# Altium project LSS_Gripper_Bottom_Board.PrjPcb (part 2 of 3)

## Sheet Controller-Sheet.SchDoc
size 420 x 297 mm; SheetNumber: 2; SheetTotal: 7
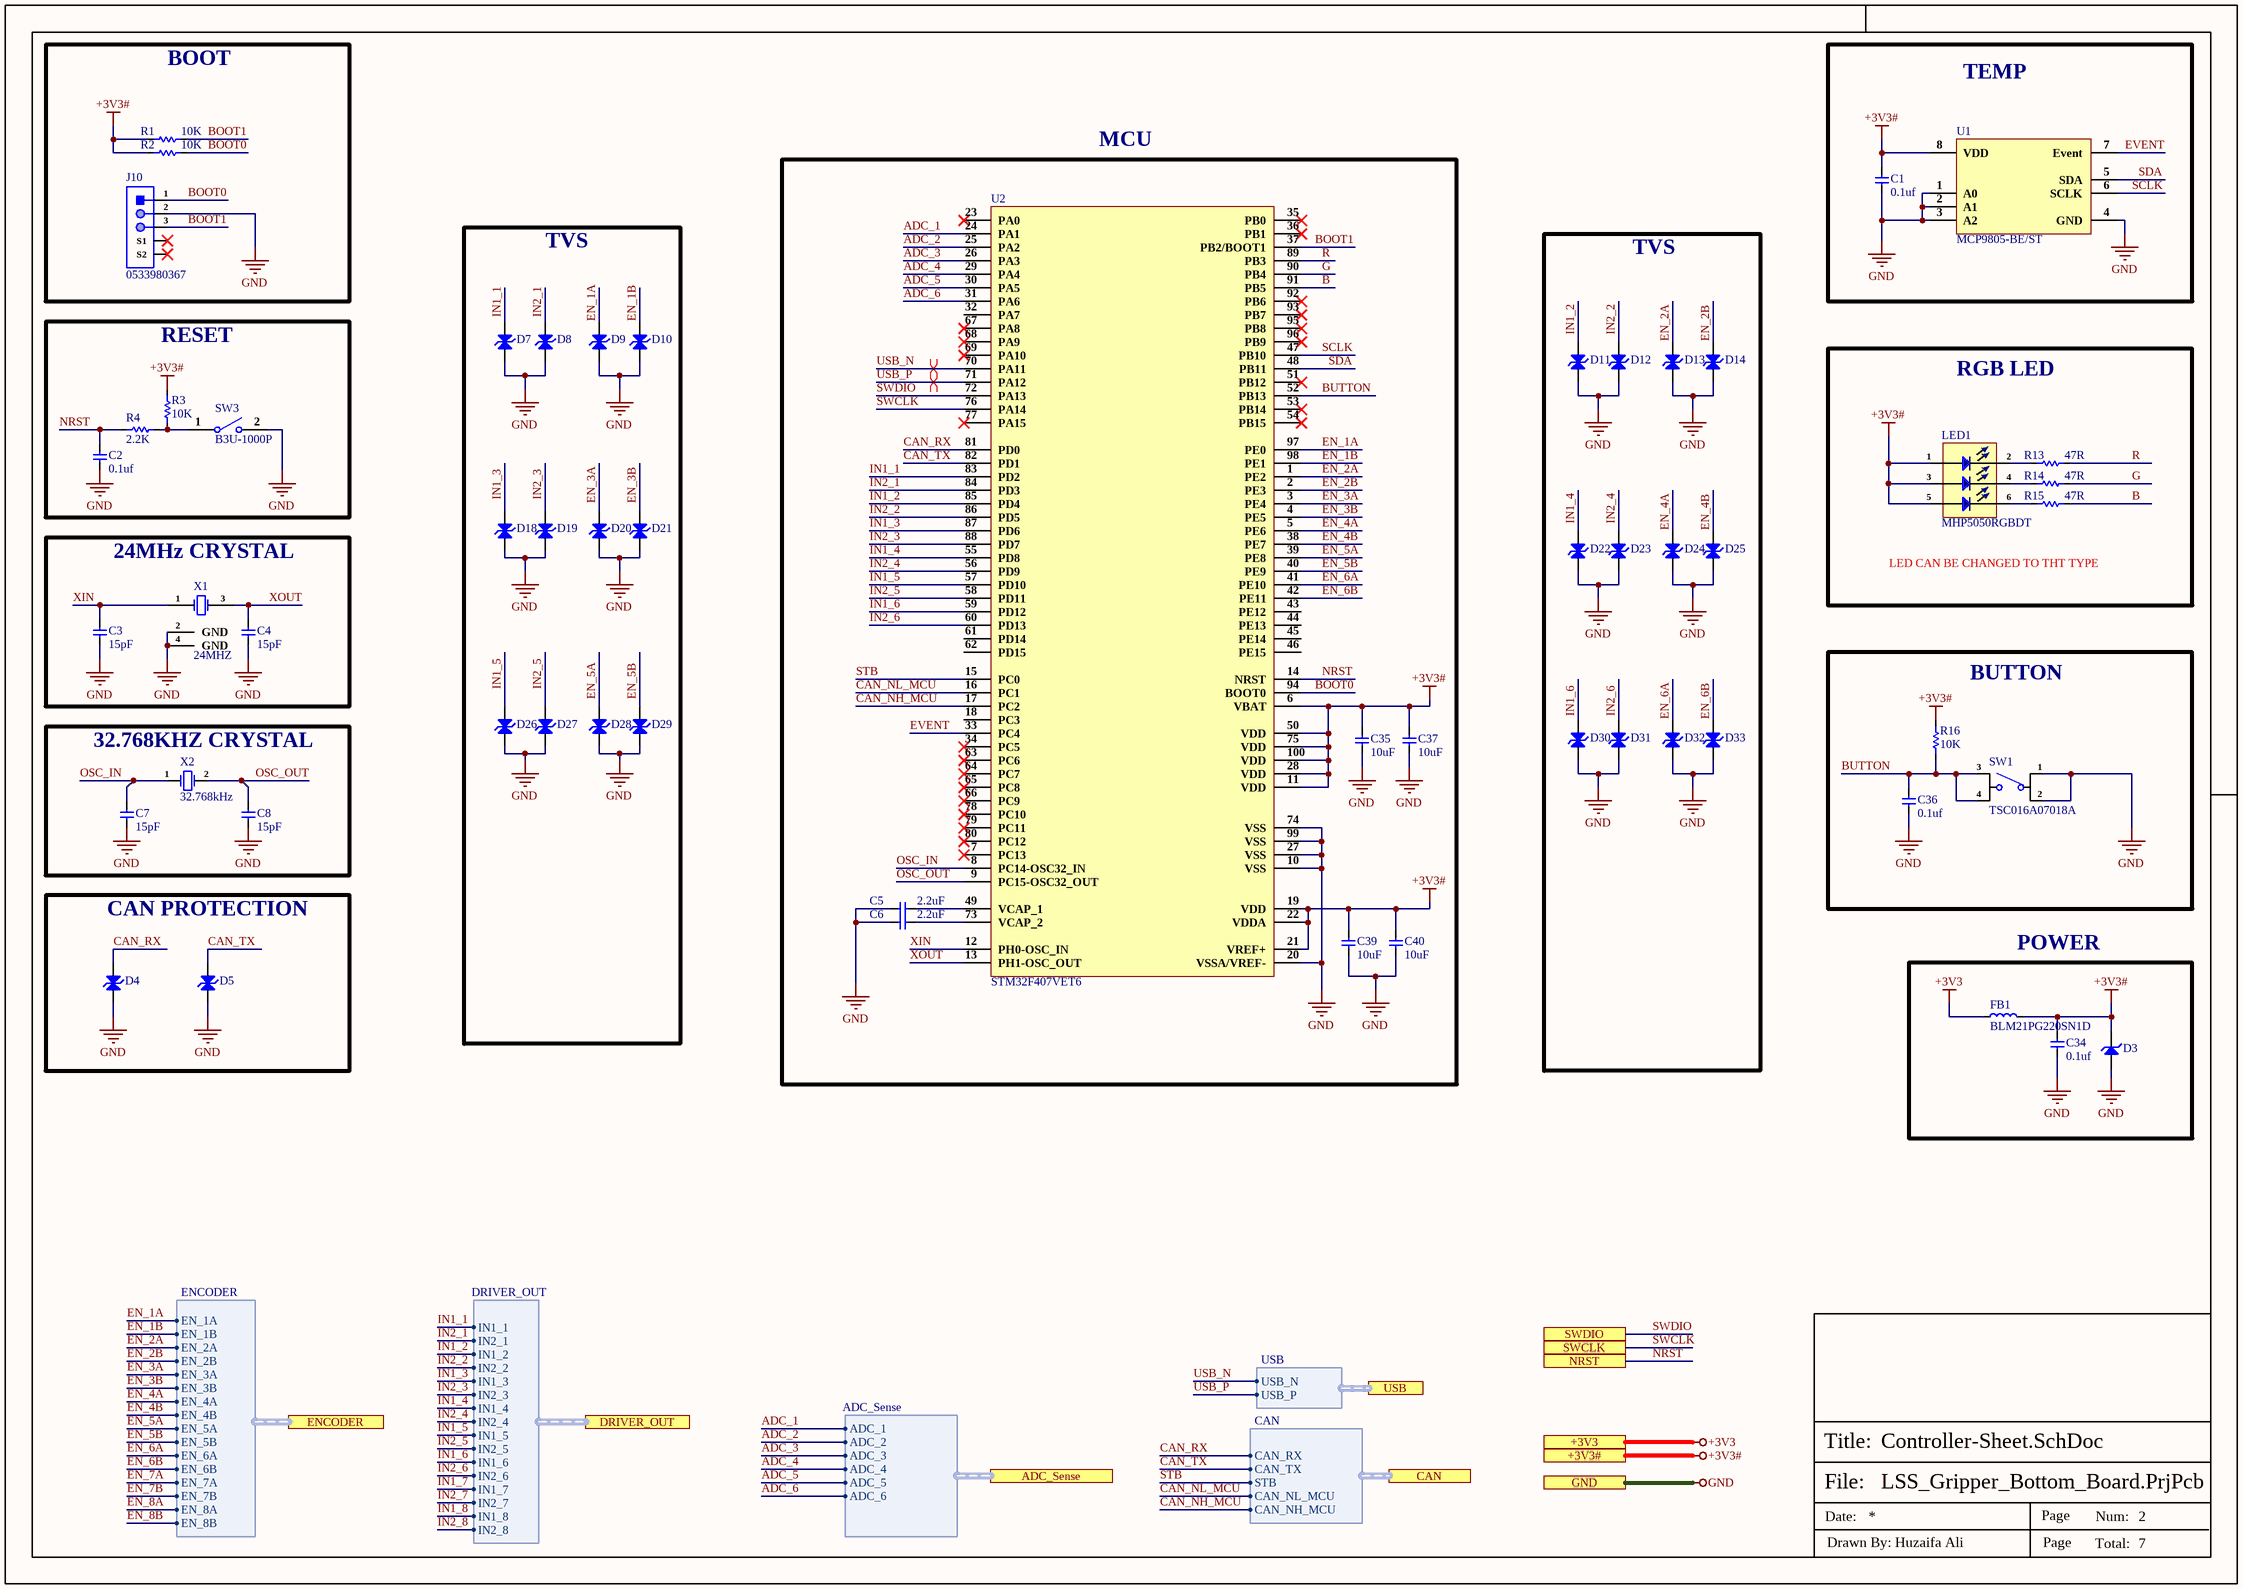
[diagram p3: Controller-Sheet.SchDoc]

### Parts
C1  0.1uf  [Cap-0402]
C2  0.1uf  [Cap-0402]
C3  15pF  [Cap-0201]
C4  15pF  [Cap-0201]
C5  2.2uF  [Cap-0402]
C6  2.2uF  [Cap-0402]
C7  15pF  [Cap-0201]
C8  15pF  [Cap-0201]
C34  0.1uf  [Cap-0402]
C35  10uF  [Cap-0402]
C36  0.1uf  [Cap-0402]
C37  10uF  [Cap-0402]
C39  10uF  [Cap-0402]
C40  10uF  [Cap-0402]
D3  AZ3003-01G  [SOD-123]  (value not drawn)
D4  PESD3V3Y1BSFYL  [DSN0603-2]  (value not drawn)
D5  PESD3V3Y1BSFYL  [DSN0603-2]  (value not drawn)
D7  PESD3V3Y1BSFYL  [DSN0603-2]  (value not drawn)
D8  PESD3V3Y1BSFYL  [DSN0603-2]  (value not drawn)
D9  PESD3V3Y1BSFYL  [DSN0603-2]  (value not drawn)
D10  PESD3V3Y1BSFYL  [DSN0603-2]  (value not drawn)
D11  PESD3V3Y1BSFYL  [DSN0603-2]  (value not drawn)
D12  PESD3V3Y1BSFYL  [DSN0603-2]  (value not drawn)
D13  PESD3V3Y1BSFYL  [DSN0603-2]  (value not drawn)
D14  PESD3V3Y1BSFYL  [DSN0603-2]  (value not drawn)
D18  PESD3V3Y1BSFYL  [DSN0603-2]  (value not drawn)
D19  PESD3V3Y1BSFYL  [DSN0603-2]  (value not drawn)
D20  PESD3V3Y1BSFYL  [DSN0603-2]  (value not drawn)
D21  PESD3V3Y1BSFYL  [DSN0603-2]  (value not drawn)
D22  PESD3V3Y1BSFYL  [DSN0603-2]  (value not drawn)
D23  PESD3V3Y1BSFYL  [DSN0603-2]  (value not drawn)
D24  PESD3V3Y1BSFYL  [DSN0603-2]  (value not drawn)
D25  PESD3V3Y1BSFYL  [DSN0603-2]  (value not drawn)
D26  PESD3V3Y1BSFYL  [DSN0603-2]  (value not drawn)
D27  PESD3V3Y1BSFYL  [DSN0603-2]  (value not drawn)
D28  PESD3V3Y1BSFYL  [DSN0603-2]  (value not drawn)
D29  PESD3V3Y1BSFYL  [DSN0603-2]  (value not drawn)
D30  PESD3V3Y1BSFYL  [DSN0603-2]  (value not drawn)
D31  PESD3V3Y1BSFYL  [DSN0603-2]  (value not drawn)
D32  PESD3V3Y1BSFYL  [DSN0603-2]  (value not drawn)
D33  PESD3V3Y1BSFYL  [DSN0603-2]  (value not drawn)
FB1  BLM21PG220SN1D  [Ind-0805]
J10  0533980367  [0533980367]
LED1  MHP5050RGBDT  [SMD5050]
R1  10K  [Res-0402]
R2  10K  [Res-0402]
R3  10K  [Res-0402]
R4  2.2K  [Res-0603]
R13  47R  [Res-0402]
R14  47R  [Res-0402]
R15  47R  [Res-0402]
R16  10K  [Res-0402]
SW1  TSC016A07018A  [TSC016A07018A]
SW3  B3U-1000P  [B3U-1000P]
U1  MCP9805-BE/ST  [8-TSSOP]
U2  STM32F407VET6  [LQFP-100]
X1  24MHZ  [X322524MOB4SI-]
X2  32.768kHz  [SMD2012-2P]

### Blocks framed on the sheet
BOOT: J10 R1 R2
TEMP: C1 U1
MCU: C5 C6 C35 C37 C39 C40 U2
TVS: D7-D10 D18-D21 D26-D29
TVS: D11-D14 D22-D25 D30-D33
RESET: C2 R3 R4 SW3
RGB LED: LED1 R13-R15
24MHz CRYSTAL: C3 C4 X1
BUTTON: C36 R16 SW1
32.768KHZ CRYSTAL: C7 C8 X2
CAN PROTECTION: D4 D5
POWER: C34 D3 FB1

### Ports
+3V3 (see Top-Sheet[3A], Connector-Sheet[5D], Motor-Driver-Sheet[5D]), +3V3# (see Top-Sheet[3A], CAN-Sheet[5D], Current-Sense-Sheet[5D]), ADC_Sense (harness ADC_Sense, see Top-Sheet[3B], Current-Sense-Sheet[3D]), CAN (harness CAN, see Top-Sheet[3B], CAN-Sheet[4D]), DRIVER_OUT (harness DRIVER_OUT, see Top-Sheet[3B], Motor-Driver-Sheet[3D]), ENCODER (harness ENCODER, see Top-Sheet[3B], Motor-Connector[2D]), GND (see Top-Sheet[3B], CAN-Sheet[5D], Connector-Sheet[5D], Current-Sense-Sheet[5D], Motor-Connector[5D], Motor-Driver-Sheet[5D]), NRST (see Top-Sheet[3A], Connector-Sheet[3D]), SWCLK (see Top-Sheet[3B], Connector-Sheet[3D]), SWDIO (see Top-Sheet[3A], Connector-Sheet[3D]), USB (harness USB, see Top-Sheet[3B], Connector-Sheet[4D])

### Harnesses
ADC_Sense: ADC_1, ADC_2, ADC_3, ADC_4, ADC_5, ADC_6
ENCODER: EN_2B, EN_3A, EN_3B, EN_4A, EN_4B, EN_5A, EN_5B, EN_6A, EN_6B, EN_7A, EN_7B, EN_2A, EN_1B, EN_1A, EN_8A, EN_8B
USB: USB_N, USB_P
DRIVER_OUT: IN1_1, IN2_1, IN1_2, IN2_2, IN1_3, IN2_3, IN1_4, IN2_4, IN1_5, IN2_5, IN1_6, IN2_6, IN1_7, IN2_7, IN1_8, IN2_8
CAN: CAN_RX, CAN_TX, STB, CAN_NL_MCU, CAN_NH_MCU

### Nets
+3V3: FB1.1 ; port +3V3
+3V3#: C1.2 C34.2 C35.2 C37.2 C39.2 C40.2 D3.2(K) FB1.2 LED1.1 LED1.3 LED1.5 R1.2 R2.2 R3.1 R16.1 U1.8(VDD) U2.6(VBAT) U2.11(VDD) U2.19(VDD) U2.21(VREF+) U2.22(VDDA) U2.28(VDD) U2.50(VDD) U2.75(VDD) U2.100(VDD) ; port +3V3#
GND: C1.1 C2.1 C3.1 C4.1 C5.1 C6.1 C7.1 C8.1 C34.1 C35.1 C36.1 C37.1 C39.1 C40.1 D3.1(A) D4.1(A) D5.1(A) D7.1(A) D8.1(A) D9.1(A) D10.1(A) D11.1(A) D12.1(A) D13.1(A) D14.1(A) D18.1(A) D19.1(A) D20.1(A) D21.1(A) D22.1(A) D23.1(A) D24.1(A) D25.1(A) D26.1(A) D27.1(A) D28.1(A) D29.1(A) D30.1(A) D31.1(A) D32.1(A) D33.1(A) J10.2 SW1.1 SW1.2 SW3.2 U1.1(A0) U1.2(A1) U1.3(A2) U1.4(GND) U2.10(VSS) U2.20(VSSA/VREF-) U2.27(VSS) U2.74(VSS) U2.99(VSS) X1.2(GND) X1.4(GND) ; port GND
ADC_1: U2.24(PA1) ; port ADC_Sense.ADC_1
ADC_2: U2.25(PA2) ; port ADC_Sense.ADC_2
ADC_3: U2.26(PA3) ; port ADC_Sense.ADC_3
ADC_4: U2.29(PA4) ; port ADC_Sense.ADC_4
ADC_5: U2.30(PA5) ; port ADC_Sense.ADC_5
ADC_6: U2.31(PA6) ; port ADC_Sense.ADC_6
B: R15.2 U2.91(PB5)
BOOT0: J10.1 R2.1 U2.94(BOOT0)
BOOT1: J10.3 R1.1 U2.37(PB2/BOOT1)
BUTTON: C36.2 R16.2 SW1.3 SW1.4 U2.52(PB13)
CAN_NH_MCU: U2.17(PC2) ; port CAN.CAN_NH_MCU
CAN_NL_MCU: U2.16(PC1) ; port CAN.CAN_NL_MCU
CAN_RX: D4.2(A) U2.81(PD0) ; port CAN.CAN_RX
CAN_TX: D5.2(A) U2.82(PD1) ; port CAN.CAN_TX
EN_1A: D9.2(A) U2.97(PE0) ; port ENCODER.EN_1A
EN_1B: D10.2(A) U2.98(PE1) ; port ENCODER.EN_1B
EN_2A: D13.2(A) U2.1(PE2) ; port ENCODER.EN_2A
EN_2B: D14.2(A) U2.2(PE3) ; port ENCODER.EN_2B
EN_3A: D20.2(A) U2.3(PE4) ; port ENCODER.EN_3A
EN_3B: D21.2(A) U2.4(PE5) ; port ENCODER.EN_3B
EN_4A: D24.2(A) U2.5(PE6) ; port ENCODER.EN_4A
EN_4B: D25.2(A) U2.38(PE7) ; port ENCODER.EN_4B
EN_5A: D28.2(A) U2.39(PE8) ; port ENCODER.EN_5A
EN_5B: D29.2(A) U2.40(PE9) ; port ENCODER.EN_5B
EN_6A: D32.2(A) U2.41(PE10) ; port ENCODER.EN_6A
EN_6B: D33.2(A) U2.42(PE11) ; port ENCODER.EN_6B
EN_7A: port ENCODER.EN_7A
EN_7B: port ENCODER.EN_7B
EN_8A: port ENCODER.EN_8A
EN_8B: port ENCODER.EN_8B
EVENT: U1.7(Event) U2.33(PC4)
G: R14.2 U2.90(PB4)
IN1_1: D7.2(A) U2.83(PD2) ; port DRIVER_OUT.IN1_1
IN1_2: D11.2(A) U2.85(PD4) ; port DRIVER_OUT.IN1_2
IN1_3: D18.2(A) U2.87(PD6) ; port DRIVER_OUT.IN1_3
IN1_4: D22.2(A) U2.55(PD8) ; port DRIVER_OUT.IN1_4
IN1_5: D26.2(A) U2.57(PD10) ; port DRIVER_OUT.IN1_5
IN1_6: D30.2(A) U2.59(PD12) ; port DRIVER_OUT.IN1_6
IN1_7: port DRIVER_OUT.IN1_7
IN1_8: port DRIVER_OUT.IN1_8
IN2_1: D8.2(A) U2.84(PD3) ; port DRIVER_OUT.IN2_1
IN2_2: D12.2(A) U2.86(PD5) ; port DRIVER_OUT.IN2_2
IN2_3: D19.2(A) U2.88(PD7) ; port DRIVER_OUT.IN2_3
IN2_4: D23.2(A) U2.56(PD9) ; port DRIVER_OUT.IN2_4
IN2_5: D27.2(A) U2.58(PD11) ; port DRIVER_OUT.IN2_5
IN2_6: D31.2(A) U2.60(PD13) ; port DRIVER_OUT.IN2_6
IN2_7: port DRIVER_OUT.IN2_7
IN2_8: port DRIVER_OUT.IN2_8
NRST: C2.2 R4.1 U2.14(NRST) ; port NRST
OSC_IN: C7.2 U2.8(PC14-OSC32_IN) X2.1(OSC1)
OSC_OUT: C8.2 U2.9(PC15-OSC32_OUT) X2.2(OSC2)
R: R13.2 U2.89(PB3)
SCLK: U1.6(SCLK) U2.47(PB10)
SDA: U1.5(SDA) U2.48(PB11)
STB: U2.15(PC0) ; port CAN.STB
SWCLK: U2.76(PA14) ; port SWCLK
SWDIO: U2.72(PA13) ; port SWDIO
USB_N: U2.70(PA11) ; port USB.USB_N
USB_P: U2.71(PA12) ; port USB.USB_P
XIN: C3.2 U2.12(PH0-OSC_IN) X1.1(CRYSTAL)
XOUT: C4.2 U2.13(PH1-OSC_OUT) X1.3(CRYSTAL)
NetC5_2: C5.2 U2.49(VCAP_1)
NetC6_2: C6.2 U2.73(VCAP_2)
NetLED1_2: LED1.2 R13.1
NetLED1_4: LED1.4 R14.1
NetLED1_6: LED1.6 R15.1
NetR3_2: R3.2 R4.2 SW3.1

Not connected (* = marked no-connect by the designer): J10 S1* S2*; U2 7(PC13)* 18(PC3) 23(PA0)* 32(PA7) 34(PC5)* 35(PB0)* 36(PB1)* 43(PE12) 44(PE13) 45(PE14) 46(PE15) 51(PB12)* 53(PB14)* 54(PB15)* 61(PD14) 62(PD15) 63(PC6)* 64(PC7)* 65(PC8)* 66(PC9)* 67(PA8)* 68(PA9)* 69(PA10)* 77(PA15)* 78(PC10)* 79(PC11)* 80(PC12)* 92(PB6)* 93(PB7)* 95(PB8)* 96(PB9)*

### Layout directives
differential pair; net class USB; differential pair class USB_Lines; rule Impedance Constraint [Min = 88.00    Max = 90.00    ]; rule Matched Net Lengths [Tolerance = 20mil]: USB_N, USB_P

### Notes on the sheet
- LED CAN BE CHANGED TO THT TYPE
- File:
- Title:
- Date:
- Page
- Num:
- Total:
- Drawn By: Huzaifa Ali

### Library data of the parts
C1 C2 C34 C36 = GRM155R62A104KE14D: CAP CER 0.1UF 100V X5R 0402; Manufacturer: Murata; Capacitance: 100nF; Tolerance: 10%; Item Type: Capacitor; Supplier 1: Arrow Electronics; Manufacturer Part Number: GRM155R62A104KE14D; RoHS: Yes; Category: Ceramic Capacitors; Stock 1: 870000; Pricing 1: 10000=0.00500, 20000=0.00410, 30000=0.00390, 50000=0.00370, 100000=0.00300 (USD); Mount: Surface Mount; Case/Package: 0402; Case Code (Metric): 1005; Case Code (Imperial): 0402; Weight: 0.000212oz; Min Operating Temperature: -55°C; Max Operating Temperature: 85°C; Packaging: Tape and Reel; Voltage Rating: 100V; Dielectric: X5R; Termination: SMD/SMT; Voltage Rating (DC): 100V; Package Quantity: 10000; Series: GRM; Length: 0.039inch; Width: 0.02inch; Height: 0.5mm; Thickness: 0.022inch; Reach SVHC Compliant: Yes; Lead Free: Lead Free; RoHS Compliant: Yes; ComponentLink1URL: http://www.farnell.com/datasheets/2079151.pdf?src-supplier=Farnell; ComponentLink1Description: http://www.farnell.com/datasheets/2079151.pdf?src-supplier=Farnell; ComponentLink2URL: http://www.mouser.com/ds/2/281/c02e-2905.pdf?src-supplier=Mouser; ComponentLink2Description: http://www.mouser.com/ds/2/281/c02e-2905.pdf?src-supplier=Mouser; ComponentLink3URL: http://www.farnell.com/datasheets/2079151.pdf?src-supplier=Element14; ComponentLink3Description: http://www.farnell.com/datasheets/2079151.pdf?src-supplier=Element14; ComponentLink4URL: http://search.murata.co.jp/Ceramy/image/img/A01X/G101/ENG/GRM155R62A104KE14-01.pdf?src-supplier=Digi-Key; ComponentLink4Description: http://search.murata.co.jp/Ceramy/image/img/A01X/G101/ENG/GRM155R62A104KE14-01.pdf?src-supplier=Digi-Key; ComponentLink5URL: http://www.farnell.com/datasheets/2079151.pdf?src-supplier=Newark; ComponentLink5Description: http://www.farnell.com/datasheets/2079151.pdf?src-supplier=Newark; Supplier Part Number 1: GRM155R62A104KE14D; LCSC Part Number: C162178
C3 C4 C7 C8 = CC0201JRNPO9BN150: CAP CER 15PF 50V C0G/NPO 0201; Manufacturer: Yageo; Item Type: Capacitor; Supplier: Future Electronics; Supplier Part Number: 2580314; Manufacturer Part Number: CC0201JRNPO9BN150; RoHS: Yes; Category: Ceramic Capacitors; Stock: 585000; Pricing: 15000=0.0012, 60000=0.0011, 225000=0.0011, 600000=0.001, 1500000=0.001 (USD); ComponentLink1URL: https://datasheet.ciiva.com/176/mlccorderingcode-176501.pdf?src-supplier=Digi-Key; ComponentLink1Description: https://datasheet.ciiva.com/176/mlccorderingcode-176501.pdf?src-supplier=Digi-Key; ComponentLink2URL: https://datasheet.ciiva.com/176/mlccorderingcode-176502.pdf?src-supplier=Digi-Key; ComponentLink2Description: https://datasheet.ciiva.com/176/mlccorderingcode-176502.pdf?src-supplier=Digi-Key; ComponentLink3URL: https://datasheet.ciiva.com/176/mlccorderingcode-176503.pdf?src-supplier=Digi-Key; ComponentLink3Description: https://datasheet.ciiva.com/176/mlccorderingcode-176503.pdf?src-supplier=Digi-Key; ComponentLink4URL: https://datasheet.ciiva.com/17205/upy-gp-np0-16v-to-50v-8-17205625.pdf?src-supplier=Future+Electronics; ComponentLink4Description: https://datasheet.ciiva.com/17205/upy-gp-np0-16v-to-50v-8-17205625.pdf?src-supplier=Future+Electronics; LCSC Part Number: C277480
C5 C6 = C1005X5R0J225KTJA0E: CAP CER 2.2UF 6.3V X5R 0402; Manufacturer: TDK; Item Type: Capacitor; LCSC Part Number: C343036; Manufacturer Part Number: C1005X5R0J225KTJA0E; ComponentLink1Description: LCSC; ComponentLink1URL: https://www.lcsc.com/product-detail/Multilayer-Ceramic-Capacitors-MLCC-SMD-SMT_TDK-C1005X5R0J225KTJA0E_C343036.html
C35 C37 C39 C40 = CL05A106MP5NUNC: CAP CER 10UF 10V X5R 0402; Manufacturer: Samsung; Tolerance: 20%; Item Type: Capacitor; Supplier 1: Avnet; Manufacturer Part Number: CL05A106MP5NUNC; RoHS: Yes; Category: Ceramic Capacitors; Stock 1: 1729850; Pricing 1: 10000=0.02537 (USD); Mount: Surface Mount; Case/Package: 0402; Case Code (Metric): 1005; Case Code (Imperial): 0402; Contact Plating: Tin; Min Operating Temperature: -55°C; Max Operating Temperature: 85°C; Package Quantity: 1; Packaging: Tape and Reel; Capacitance: 10uF; Voltage Rating: 10V; Dielectric: X5R; Termination: Wraparound; Series: CL; Construction: Flat; Length: 1mm; Width: 0.02inch; Thickness: 0.028inch; Depth: 0.5mm; Radiation Hardening: No; Lead Free: Lead Free; RoHS Compliant: Yes; ComponentLink1URL: https://datasheet.ciiva.com/25721/cl05a106mp5nunc-25721584.pdf?src-supplier=Digi-Key; ComponentLink1Description: https://datasheet.ciiva.com/25721/cl05a106mp5nunc-25721584.pdf?src-supplier=Digi-Key; ComponentLink2URL: https://datasheet.ciiva.com/26838/getdatasheetpartid-745310-26838170.pdf?src-supplier=Verical; ComponentLink2Description: https://datasheet.ciiva.com/26838/getdatasheetpartid-745310-26838170.pdf?src-supplier=Verical; Supplier Part Number 1: CL05A106MP5NUNC; LCSC Part Number: C315248
D3 = AZ3003-01G: TVS SURGE PROTECTOR 1-CH 3.3V; Manufacturer: Amazing; Item Type: Diode; Manufacturer Part Number: AZ3003-01G; Package: SOD-123; LCSC Part Number: -; ComponentLink1Description: Digikey; ComponentLink1URL: https://www.digikey.com/en/products/detail/amazing/AZ3003-01G/16615352?s=N4IgTCBcDaIIIC0DMAGFSC0KCMBxEAugL5A
D4 D5 D7-D14 D18-D33 = PESD3V3Y1BSFYL: TVS DIODE 3.3VWM 3.7VC DSN0603-2; Manufacturer: Nexperia; Item Type: TVS Diodes; Supplier: Future Electronics; Supplier Part Number: 9101291; Manufacturer Part Number: PESD3V3Y1BSFYL; RoHS: No; Stock: 9000; Pricing: 9000=0.0488, 18000=0.0477, 36000=0.0466, 45000=0.0463, 135000=0.0442 (USD); ComponentLink1URL: http://www.farnell.com/datasheets/2621606.pdf?src-supplier=Farnell; ComponentLink1Description: http://www.farnell.com/datasheets/2621606.pdf?src-supplier=Farnell; ComponentLink2URL: http://www.farnell.com/datasheets/2621606.pdf?src-supplier=Newark; ComponentLink2Description: http://www.farnell.com/datasheets/2621606.pdf?src-supplier=Newark; LCSC Part Number: C552535
FB1 = BLM21PG220SN1D: FERRITE BEAD 22 OHM 0805 1LN; Manufacturer: Murata; Supplier: Rs; Supplier Part Number: 7241539P; Manufacturer Part Number: BLM21PG220SN1D; RoHS: Yes; Category: Ferrite Beads and Chips; Stock: 10325; Pricing: 500=0.043, 1000=0.038, 2500=0.033, 5000=0.03 (GBP); ComponentLink1URL: https://datasheet.ciiva.com/14122/anblm21p-data-e-14122211.pdf?src-supplier=Distrelec; ComponentLink1Description: https://datasheet.ciiva.com/14122/anblm21p-data-e-14122211.pdf?src-supplier=Distrelec; ComponentLink2URL: https://datasheet.ciiva.com/11799/0900766b81275e31-11799177.pdf?src-supplier=Rs; ComponentLink2Description: https://datasheet.ciiva.com/11799/0900766b81275e31-11799177.pdf?src-supplier=Rs; ComponentLink3URL: https://datasheet.ciiva.com/29700/1845312-29700540.pdf?src-supplier=Jameco; ComponentLink3Description: https://datasheet.ciiva.com/29700/1845312-29700540.pdf?src-supplier=Jameco; ComponentLink4URL: https://datasheet.ciiva.com/16291/l0110s0100blm21p-16291622.pdf?src-supplier=Future+Electronics; ComponentLink4Description: https://datasheet.ciiva.com/16291/l0110s0100blm21p-16291622.pdf?src-supplier=Future+Electronics; ComponentLink5URL: https://datasheet.ciiva.com/8021/5160-8021589.pdf?src-supplier=Element14; ComponentLink5Description: https://datasheet.ciiva.com/8021/5160-8021589.pdf?src-supplier=Element14; ComponentLink6URL: https://datasheet.ciiva.com/8021/5160-8021591.pdf?src-supplier=Element14; ComponentLink6Description: https://datasheet.ciiva.com/8021/5160-8021591.pdf?src-supplier=Element14; ComponentLink7URL: https://datasheet.ciiva.com/6211/l0110s0100blm21p-6211741.pdf?src-supplier=Digi-Key; ComponentLink7Description: https://datasheet.ciiva.com/6211/l0110s0100blm21p-6211741.pdf?src-supplier=Digi-Key; ComponentLink8URL: https://datasheet.ciiva.com/3081/l0110s0100blm21p-3081653.pdf?src-supplier=Avnet; ComponentLink8Description: https://datasheet.ciiva.com/3081/l0110s0100blm21p-3081653.pdf?src-supplier=Avnet; ComponentLink9URL: https://datasheet.ciiva.com/41449/001171738-da-01-en-chip-drossel0805-22r0-6000ma-2-0x1-25mm-41449366.pdf?src-supplier=Conrad; ComponentLink9Description: https://datasheet.ciiva.com/41449/001171738-da-01-en-chip-drossel0805-22r0-6000ma-2-0x1-25mm-41449366.pdf?src-supplier=Conrad; LCSC Part Number: C88993; Item Type: Ferrite Bead
J10 = 0533980367: CONN HEADER SMD 3POS 1.25MM; Manufacturer: Molex; Item Type: Wire To Board Connector; Supplier: Mouser; Supplier Part Number: 538-53398-0367; Manufacturer Part Number: 0533980367; RoHS: Yes; Stock: 5361; Pricing: 1=1.41, 10=1.17, 50=1.17, 100=0.963, 1000=0.77, 10000=0.634 (USD); ComponentLink1URL: https://datasheet.ciiva.com/2944/533980367-sd-2944045.pdf?src-supplier=Digikey; ComponentLink1Description: https://datasheet.ciiva.com/2944/533980367-sd-2944045.pdf?src-supplier=Digikey; LCSC Part Number: C17555262
LED1 = MHP5050RGBDT: 20mA White Diffused -40℃~+85℃ RGB SMD5050 Light Emitting Diodes (LED) ROHS; Manufacturer: MEIHUA; Item Type: RGB LED; Manufacturer Part Number: MHP5050RGBDT; LCSC Part Number: C409780; Package: SMD5050; ComponentLink1Description: LCSC; ComponentLink1URL: https://www.lcsc.com/product-detail/Light-Emitting-Diodes-LED_MEIHUA-MHP5050RGBDT_C409780.html
R1-R3 R16 = RC0402FR-0710KL: RES 10K OHM 1% 1/16W 0402; Manufacturer: Yageo; Resistance: 10kR; Voltage Rating (DC): 50V; Temperature Coefficient: 100ppm/°C; Power Rating: 62.5mW; Max Power Dissipation: 63mW; Item Type: Resistor; Supplier 1: Mouser; Manufacturer Part Number: RC0402FR-0710KL; RoHS: Yes; Category: Chip SMD Resistors; Stock 1: 18648329; Pricing 1: 1=0.10000, 10=0.01400, 50=0.01400, 100=0.00500, 1000=0.00300, 10000=0.00200 (USD); Case/Package: 0402; Number of Pins: 2; Case Code (Imperial): 0402; Case Code (Metric): 1005; Min Operating Temperature: -55°C; Max Operating Temperature: 155°C; Resistor Type: Thick Film; Tolerance: 1%; Packaging: Tape and Reel; Voltage Rating: 50V; Termination: SMD/SMT; Working Voltage: 50V; Number of Terminations: 2; Features: Moisture Resistant; Series: RC; Resistance Tolerance: 1%; Construction: Rectangular; Length: 1mm; Width: 0.5mm; Height: 0.32mm; Depth: 0.5mm; Lead Pitch: 0.2mm; REACH SVHC: No SVHC; Lead Free: Lead Free; RoHS Compliant: Yes; Military Standard: Not; ComponentLink1URL: https://datasheet.ciiva.com/7660/38568-7660787.pdf?src-supplier=Element14; ComponentLink1Description: https://datasheet.ciiva.com/7660/38568-7660787.pdf?src-supplier=Element14; ComponentLink2URL: https://datasheet.ciiva.com/7849/1686128-7849814.pdf?src-supplier=Element14; ComponentLink2Description: https://datasheet.ciiva.com/7849/1686128-7849814.pdf?src-supplier=Element14; ComponentLink3URL: https://datasheet.ciiva.com/7983/1018594-7983486.pdf?src-supplier=Element14; ComponentLink3Description: https://datasheet.ciiva.com/7983/1018594-7983486.pdf?src-supplier=Element14; ComponentLink4URL: https://datasheet.ciiva.com/22747/1018594-22747512.pdf?src-supplier=Element14; ComponentLink4Description: https://datasheet.ciiva.com/22747/1018594-22747512.pdf?src-supplier=Element14; ComponentLink5URL: https://datasheet.ciiva.com/12667/pyu-rc0402-51-rohs-l-6-r-12667067.pdf?src-supplier=Mouser; ComponentLink5Description: https://datasheet.ciiva.com/12667/pyu-rc0402-51-rohs-l-6-r-12667067.pdf?src-supplier=Mouser; ComponentLink6URL: https://datasheet.ciiva.com/7849/1784430-7849813.pdf?src-supplier=Element14; ComponentLink6Description: https://datasheet.ciiva.com/7849/1784430-7849813.pdf?src-supplier=Element14; ComponentLink7URL: https://datasheet.ciiva.com/7849/1784430-7849815.pdf?src-supplier=Element14; ComponentLink7Description: https://datasheet.ciiva.com/7849/1784430-7849815.pdf?src-supplier=Element14; Supplier Part Number 1: 603-RC0402FR-0710KL; LCSC Part Number: C60490
R4 = RT0603BRB072K2L: RES SMD 2.2K OHM 0.1% 1/10W 0603; Manufacturer: Yageo; Value: 2.2kR; Max Power Dissipation: 100mW; Temperature Coefficient: 10ppm/°C; Item Type: Resistor; Supplier: Digi-Key; Supplier Part Number: YAG2182CT-ND; Manufacturer Part Number: RT0603BRB072K2L; RoHS: Yes; Category: Chip SMD Resistors; Stock: 518; Pricing: 1=0.6, 10=0.446, 50=0.3148, 100=0.2597, 500=0.1836, 1000=0.14563 (USD); Case/Package: 0603; Case Code (Metric): 1608; Case Code (Imperial): 0603; Min Operating Temperature: -55°C; Max Operating Temperature: 155°C; Packaging: Cut Tape; Number of Terminations: 2; Tolerance: 0.1%; Series: RT; RoHS Compliant: Yes; ComponentLink1URL: http://www.yageo.com/documents/recent/PYu-RT_1-to-0.01_RoHS_L_7.pdf?src-supplier=Digi-Key; ComponentLink1Description: http://www.yageo.com/documents/recent/PYu-RT_1-to-0.01_RoHS_L_7.pdf?src-supplier=Digi-Key; ComponentLink2URL: http://www.yageo.com/documents/recent/PYu-RT_1-to-0.01_RoHS_L_9.pdf?src-supplier=Digi-Key; ComponentLink2Description: http://www.yageo.com/documents/recent/PYu-RT_1-to-0.01_RoHS_L_9.pdf?src-supplier=Digi-Key; LCSC Part Number: C860297
R13-R15 = RC0402FR-0747RL: RES 47 OHM 1% 1/16W 0402; Manufacturer: Yageo; Temperature Coefficient: 100ppm/°C; Power Rating: 63mW; Voltage Rating: 50V; Item Type: Resistor; Supplier 1: Avnet; Manufacturer Part Number: RC0402FR-0747RL; RoHS: Yes; Category: Chip SMD Resistors; Stock 1: 390000; Pricing 1: 10000=0.00085 (USD); Case/Package: 0402; Case Code (Metric): 1005; Case Code (Imperial): 0402; Weight: 2.3E-05oz; Size Code: 0402; Min Operating Temperature: -55°C; Max Operating Temperature: 155°C; Resistance: 47R; Tolerance: 1%; Packaging: Tape and Reel; Resistor Type: Thick Film; Package Quantity: 1; Number of Terminations: 2; Termination: SMD/SMT; Max Power Dissipation: 63mW; Features: Moisture Resistant; Series: RC; Construction: Rectangular; Technology: THICK FILM; Resistance Tolerance: 1%; Length: 1mm; Width: 0.02inch; Height: 0.016inch; Depth: 0.5mm; Lead Free: Lead Free; Military Standard: Not; RoHS Compliant: Yes; Supplier Part Number 1: RC0402FR-0747RL; LCSC Part Number: C137973; ComponentLink1Description: LCSC; ComponentLink1URL: https://www.lcsc.com/product-detail/Chip-span-style-background-color-ff0-Resistor-span-Surface-Mount_YAGEO-RC0402FR-0747RL_C137973.html
SW1 = TSC016A07018A: 4.5mm 7mm 50mA Round Button Straight 4.5mm 180gf 12V Plugin Tactile Switches ROHS; Manufacturer: BZCN; Item Type: Connector; Manufacturer Part Number: TSC016A07018A; LCSC Part Number: C2888497; Package: Plugin
SW3 = B3U-1000P: SWITCH TACTILE SPST-NO 0.05A 12V; Manufacturer: Omron; Mechanical Life: 200000Cycles; Operating Force: 1.5N; Throw Configuration: SPST; Current Rating: 50mA; Contact Resistance: 100mR; Illumination Type: Non-Illuminated,Illuminated; Switch Travel: 0.15mm; Switch Function: Off-Mom; Actuator Type: Standard; Actuator Length: 0.4mm; Ratings: Dust Proof,IP40; ComponentLink1URL: http://www.farnell.com/datasheets/60838.pdf?src-supplier=Farnell; ComponentLink1Description: http://www.farnell.com/datasheets/60838.pdf?src-supplier=Farnell; ComponentLink2URL: http://www.farnell.com/datasheets/60838.pdf?src-supplier=Element14; ComponentLink2Description: http://www.farnell.com/datasheets/60838.pdf?src-supplier=Element14; ComponentLink3URL: https://omronfs.omron.com/en_US/ecb/products/pdf/en-b3u.pdf?src-supplier=Digi-Key; ComponentLink3Description: https://omronfs.omron.com/en_US/ecb/products/pdf/en-b3u.pdf?src-supplier=Digi-Key; ComponentLink4URL: http://www.omron.com/ecb/products/pdf/en-b3u.pdf?src-supplier=Digi-Key; ComponentLink4Description: http://www.omron.com/ecb/products/pdf/en-b3u.pdf?src-supplier=Digi-Key; ComponentLink5URL: https://www.distrelec.biz/Web/Downloads/he/et/B3U_eng_datasheet.pdf?mime=application%2Fpdf&src-supplier=Distrelec; ComponentLink5Description: https://www.distrelec.biz/Web/Downloads/he/et/B3U_eng_datasheet.pdf?mime=application%2Fpdf&src-supplier=Distrelec; ComponentLink6URL: http://www.onlinecomponents.com/productFiles/mf-OM/en-b3u.pdf?src-supplier=Onlinecomponents.com; ComponentLink6Description: http://www.onlinecomponents.com/productFiles/mf-OM/en-b3u.pdf?src-supplier=Onlinecomponents.com; Supplier 1: Digi-Key; Manufacturer Part Number: B3U-1000P; Stock 1: 116454; Pricing 1: 1=1, 10=0.961, 25=0.9064, 50=0.7976, 100=0.7251, 250=0.68888, 500=0.67074, 1000=0.52571 (USD); Mount: Surface Mount; Weight: 0.000776oz; Contact Material: Silver; Min Operating Temperature: -25°C; Max Operating Temperature: 70°C; Packaging: Tape and Reel; Voltage Rating (DC): 12V; Package Quantity: 1; Max Current Rating: 50mA; Termination: SMD/SMT; Orientation: Straight; Max Voltage Rating (DC): 12V; Electrical Life: 200000Cycles; Insulation Resistance: 100MR; Contact Current Rating: 50mA; Length: 4mm; Height: 1.2mm; Depth: 2.5mm; Width: 3mm; REACH SVHC: Unknown; Lead Free: Lead Free; ComponentLink7URL: https://www.verical.com/server-webapp/html/getDatasheet?partID=552554&src-supplier=Verical; ComponentLink7Description: https://www.verical.com/server-webapp/html/getDatasheet?partID=552554&src-supplier=Verical; ComponentLink8URL: http://www.farnell.com/datasheets/1685550.pdf?src-supplier=Element14; ComponentLink8Description: http://www.farnell.com/datasheets/1685550.pdf?src-supplier=Element14; ComponentLink9URL: http://www.farnell.com/datasheets/2610940.pdf?src-supplier=Farnell; ComponentLink9Description: http://www.farnell.com/datasheets/2610940.pdf?src-supplier=Farnell; ComponentLink10URL: https://www.alliedelec.com/m/d/4c8a9ef82804fc3c241a13c1e298fd73.pdf?src-supplier=Allied+Electronics; ComponentLink10Description: https://www.alliedelec.com/m/d/4c8a9ef82804fc3c241a13c1e298fd73.pdf?src-supplier=Allied+Electronics; Supplier Part Number 1: SW1020DKR-ND; LCSC Part Number: C231329; Item Type: Switch
U1 = MCP9805-BE/ST: IC SENSOR THERMAL 3.0V 8TSSOP; Manufacturer: Microchip; Min Supply Voltage: 3V; Max Supply Voltage: 3.6V; Output Current: 1uA; Interface: I2C,SMBus,2-Wire,Serial; Resolution: 10b; Operating Supply Current: 200uA; Accuracy: 2%; Number of Bits: 10; Output Type: I2C,Digital; Sensor Type: Temperature; Sensing Method: Resistive; ComponentLink1URL: https://datasheet.ciiva.com/22737/1678782-22737270.pdf?src-supplier=Element14; ComponentLink1Description: https://datasheet.ciiva.com/22737/1678782-22737270.pdf?src-supplier=Element14; ComponentLink2URL: https://datasheet.ciiva.com/43467/1678782-43467032.pdf?src-supplier=Farnell; ComponentLink2Description: https://datasheet.ciiva.com/43467/1678782-43467032.pdf?src-supplier=Farnell; ComponentLink3URL: https://datasheet.ciiva.com/22673/1678782-22673662.pdf?src-supplier=Element14; ComponentLink3Description: https://datasheet.ciiva.com/22673/1678782-22673662.pdf?src-supplier=Element14; Supplier 1: Digi-Key; Manufacturer Part Number: MCP9805-BE/ST; RoHS: Yes; Category: Power Management ICs; Stock 1: 667; Pricing 1: 1=0.85000, 25=0.71000, 100=0.65000 (USD); Mount: Surface Mount; Case/Package: TSSOP; Number of Pins: 8; Min Operating Temperature: -40°C; Max Operating Temperature: 125°C; Package Quantity: 100; Packaging: Rail/Tube; Max Supply Voltage (DC): 3.6V; Min Supply Voltage (DC): 3V; Termination: SMD/SMT; Length: 3mm; Width: 4.4mm; Height: 1mm; Radiation Hardening: No; REACH SVHC: No SVHC; Lead Free: Lead Free; RoHS Compliant: Yes; ComponentLink4URL: https://datasheet.ciiva.com/1514/1791047-1514016.pdf?src-supplier=Element14; ComponentLink4Description: https://datasheet.ciiva.com/1514/1791047-1514016.pdf?src-supplier=Element14; ComponentLink5URL: https://datasheet.ciiva.com/2003/21977b-2003478.pdf?src-supplier=Digi-Key; ComponentLink5Description: https://datasheet.ciiva.com/2003/21977b-2003478.pdf?src-supplier=Digi-Key; ComponentLink6URL: https://datasheet.ciiva.com/5299/21977b-77986-5299688.pdf?src-supplier=Mouser; ComponentLink6Description: https://datasheet.ciiva.com/5299/21977b-77986-5299688.pdf?src-supplier=Mouser; ComponentLink7URL: https://datasheet.ciiva.com/3279/21977b-3279902.pdf?src-supplier=Avnet; ComponentLink7Description: https://datasheet.ciiva.com/3279/21977b-3279902.pdf?src-supplier=Avnet; Supplier Part Number 1: MCP9805-BE/ST-ND; LCSC Part Number: C636441; Item Type: IC
U2 = STM32F407VET6: IC MCU 32BIT 512KB FLASH 100LQFP; Manufacturer: STMicroelectronics; Frequency: 168MHz; Number of I/Os: 82; Interface: I2C,SPI,CAN,I2S,UART,USB,Ethernet,IrDA,USART,LIN,EBI/EMI; Oscillator Type: Internal; Peripherals: Brown-out Detect/Reset,POR,PWM,WDT,DMA,LCD,I2C; Core Architecture: ARM; RAM Size: 196KB; Number of ADC Channels: 16; Number of Ethernet Channels: 1; Number of Timers/Counters: 14; Number of UART Channels: 2; Max Supply Voltage: 3.6V; Min Supply Voltage: 1.8V; Data Bus Width: 32b; Number of SPI Channels: 3; Watchdog Timer: Yes; Supplier 1: Newark; Manufacturer Part Number: STM32F407VET6; RoHS: Yes; Category: Microcontrollers; Pricing 1: 1=16.05000, 10=14.76000, 25=14.15000, 50=13.31000, 100=12.47000 (USD); Case/Package: LQFP; Number of Pins: 100; Min Operating Temperature: -40°C; Max Operating Temperature: 85°C; Packaging: Tray; Memory Type: FLASH; Memory Size: 512KB; Package Quantity: 90; Number of Programmable I/O: 82; Max Frequency: 168MHz; Number of I2C Channels: 3; Series: STM32 F4; Number of PWM Channels: 2; Length: 14.2mm; Width: 14.2mm; Height: 1.45mm; Radiation Hardening: No; RoHS Compliant: Yes; REACH SVHC: No SVHC; Lead Free: Lead Free; ComponentLink1URL: https://datasheet.ciiva.com/16330/dm00037051-16330920.pdf?src-supplier=Future+Electronics; ComponentLink1Description: https://datasheet.ciiva.com/16330/dm00037051-16330920.pdf?src-supplier=Future+Electronics; ComponentLink2URL: https://datasheet.ciiva.com/8055/1717982-8055038.pdf?src-supplier=Element14; ComponentLink2Description: https://datasheet.ciiva.com/8055/1717982-8055038.pdf?src-supplier=Element14; ComponentLink3URL: https://datasheet.ciiva.com/4837/dm00037051-492832-4837637.pdf?src-supplier=Mouser; ComponentLink3Description: https://datasheet.ciiva.com/4837/dm00037051-492832-4837637.pdf?src-supplier=Mouser; Supplier Part Number 1: 73T7121; LCSC Part Number: C28730; Item Type: IC
X1 = X322524MOB4SI: 24MHz SMD Crystal Resonator 12pF ±10ppm ±30ppm -40℃~+85℃ SMD3225-4P Crystals ROHS; Manufacturer: Yangxing Tech; ComponentLink1Description: LCSC; ComponentLink1URL: https://www.lcsc.com/product-detail/Crystals_Yangxing-Tech-X322524MOB4SI_C70590.html; Manufacturer Part Number: X322524MOB4SI; Footprint: Custom; LCSC Part Number: C70590; Item Type: Crystal
X2 = FC-12M32.768KHZ7PF20PPM: CRYSTAL 32.7680KHZ 9PF SMD; Manufacturer: Seiko Epson; ComponentLink1Description: LCSC; ComponentLink1URL: https://www.lcsc.com/product-detail/Crystals_Seiko-Epson-FC-12M32-768KHZ7PF20PPM_C99009.html; Manufacturer Part Number: FC-12M32.768KHZ7PF20PPM; Package: SMD2012-2P; LCSC Part Number: C99009; Item Type: Crystal

## Sheet Current-Sense-Sheet.SchDoc
size 420 x 297 mm; SheetNumber: 5; SheetTotal: 7
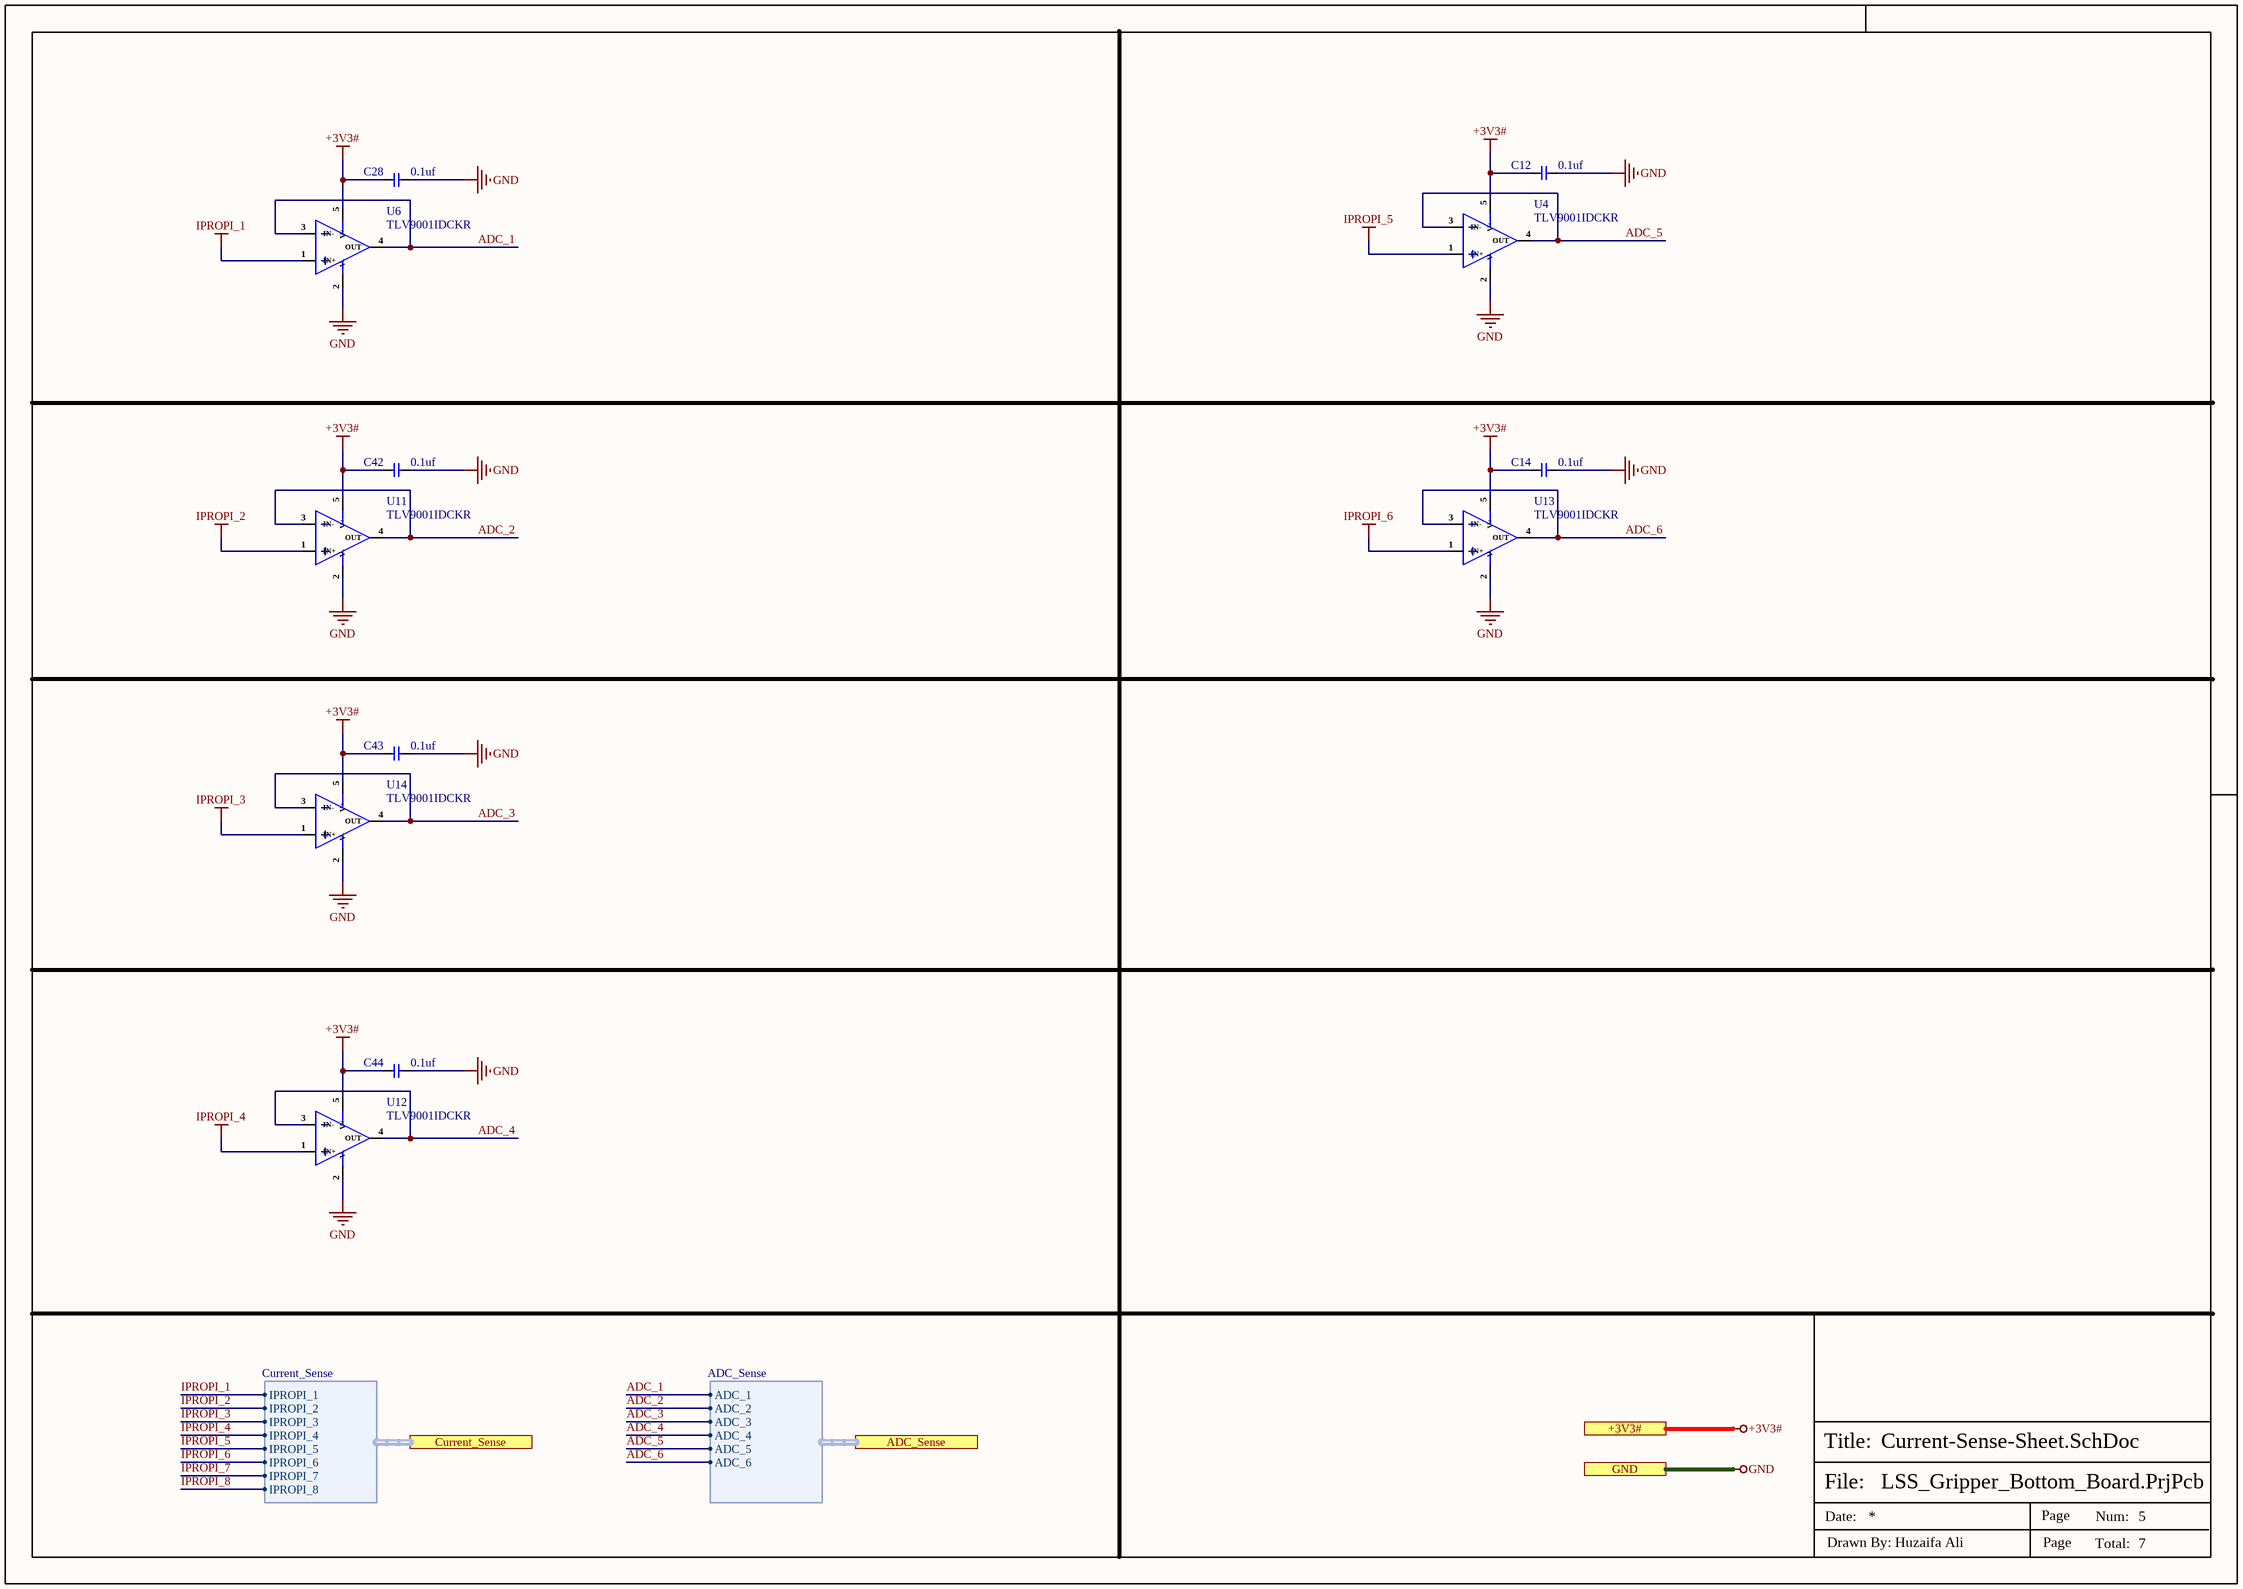
[diagram p4: Current-Sense-Sheet.SchDoc]

### Parts
C12  0.1uf  [Cap-0402]
C14  0.1uf  [Cap-0402]
C28  0.1uf  [Cap-0402]
C42  0.1uf  [Cap-0402]
C43  0.1uf  [Cap-0402]
C44  0.1uf  [Cap-0402]
U4  TLV9001IDCKR  [SC-70-5]
U6  TLV9001IDCKR  [SC-70-5]
U11  TLV9001IDCKR  [SC-70-5]
U12  TLV9001IDCKR  [SC-70-5]
U13  TLV9001IDCKR  [SC-70-5]
U14  TLV9001IDCKR  [SC-70-5]

### Ports
+3V3# (see Top-Sheet[4A], CAN-Sheet[5D], Controller-Sheet[5D]), ADC_Sense (harness ADC_Sense, see Top-Sheet[4B], Controller-Sheet[3D]), Current_Sense (harness Current_Sense, see Top-Sheet[5B], Motor-Driver-Sheet[2D]), GND (see Top-Sheet[4B], CAN-Sheet[5D], Connector-Sheet[5D], Controller-Sheet[5D], Motor-Connector[5D], Motor-Driver-Sheet[5D])

### Harnesses
Current_Sense: IPROPI_1, IPROPI_2, IPROPI_3, IPROPI_4, IPROPI_5, IPROPI_6, IPROPI_7, IPROPI_8
ADC_Sense: ADC_1, ADC_2, ADC_3, ADC_4, ADC_5, ADC_6

### Nets
+3V3#: C12.1 C14.1 C28.1 C42.1 C43.1 C44.1 U4.5(V+) U6.5(V+) U11.5(V+) U12.5(V+) U13.5(V+) U14.5(V+) ; port +3V3#
GND: C12.2 C14.2 C28.2 C42.2 C43.2 C44.2 U4.2(V-) U6.2(V-) U11.2(V-) U12.2(V-) U13.2(V-) U14.2(V-) ; port GND
IPROPI_1: U6.1(IN+) ; port Current_Sense.IPROPI_1
IPROPI_2: U11.1(IN+) ; port Current_Sense.IPROPI_2
IPROPI_3: U14.1(IN+) ; port Current_Sense.IPROPI_3
IPROPI_4: U12.1(IN+) ; port Current_Sense.IPROPI_4
IPROPI_5: U4.1(IN+) ; port Current_Sense.IPROPI_5
IPROPI_6: U13.1(IN+) ; port Current_Sense.IPROPI_6
ADC_1: U6.3(IN-) U6.4(OUT) ; port ADC_Sense.ADC_1
ADC_2: U11.3(IN-) U11.4(OUT) ; port ADC_Sense.ADC_2
ADC_3: U14.3(IN-) U14.4(OUT) ; port ADC_Sense.ADC_3
ADC_4: U12.3(IN-) U12.4(OUT) ; port ADC_Sense.ADC_4
ADC_5: U4.3(IN-) U4.4(OUT) ; port ADC_Sense.ADC_5
ADC_6: U13.3(IN-) U13.4(OUT) ; port ADC_Sense.ADC_6
IPROPI_7: port Current_Sense.IPROPI_7
IPROPI_8: port Current_Sense.IPROPI_8

### Notes on the sheet
- File:
- Title:
- Date:
- Page
- Num:
- Total:
- Drawn By: Huzaifa Ali

### Library data of the parts
C12 C14 C28 C42-C44 = GRM155R62A104KE14D: as C1 on sheet Controller-Sheet; Supplier 1: Arrow Electronics; Manufacturer Part Number: GRM155R62A104KE14D; RoHS: Yes; Category: Ceramic Capacitors; Stock 1: 870000; Pricing 1: 10000=0.00500, 20000=0.00410, 30000=0.00390, 50000=0.00370, 100000=0.00300 (USD); Mount: Surface Mount; Case/Package: 0402; Case Code (Metric): 1005; Case Code (Imperial): 0402; Weight: 0.000212oz; Min Operating Temperature: -55°C; Max Operating Temperature: 85°C; Packaging: Tape and Reel; Voltage Rating: 100V; Dielectric: X5R; Termination: SMD/SMT; Voltage Rating (DC): 100V; Package Quantity: 10000; Series: GRM; Length: 0.039inch; Width: 0.02inch; Height: 0.5mm; Thickness: 0.022inch; Reach SVHC Compliant: Yes; Lead Free: Lead Free; RoHS Compliant: Yes; ComponentLink1URL: http://www.farnell.com/datasheets/2079151.pdf?src-supplier=Farnell; ComponentLink1Description: http://www.farnell.com/datasheets/2079151.pdf?src-supplier=Farnell; ComponentLink2URL: http://www.mouser.com/ds/2/281/c02e-2905.pdf?src-supplier=Mouser; ComponentLink2Description: http://www.mouser.com/ds/2/281/c02e-2905.pdf?src-supplier=Mouser; ComponentLink3URL: http://www.farnell.com/datasheets/2079151.pdf?src-supplier=Element14; ComponentLink3Description: http://www.farnell.com/datasheets/2079151.pdf?src-supplier=Element14; ComponentLink4URL: http://search.murata.co.jp/Ceramy/image/img/A01X/G101/ENG/GRM155R62A104KE14-01.pdf?src-supplier=Digi-Key; ComponentLink4Description: http://search.murata.co.jp/Ceramy/image/img/A01X/G101/ENG/GRM155R62A104KE14-01.pdf?src-supplier=Digi-Key; ComponentLink5URL: http://www.farnell.com/datasheets/2079151.pdf?src-supplier=Newark; ComponentLink5Description: http://www.farnell.com/datasheets/2079151.pdf?src-supplier=Newark; Supplier Part Number 1: GRM155R62A104KE14D; LCSC Part Number: C162178
U4 U6 U11-U14 = TLV9001IDCKR: IC CMOS 1 CIRCUIT SC70-5; Manufacturer: Texas Instruments; Number of Channels: 1; Slew Rate: 2V/µs; Gain Bandwidth Product: 1MHz; Input Bias Current: 5pA; Input Offset Voltage (Vos): 400uV; Operating Supply Current: 60uA; Output Current per Channel: 40mA; Supplier: Mouser; Supplier Part Number: 595-TLV9001IDCKR; Manufacturer Part Number: TLV9001IDCKR; RoHS: Yes; Item Type: IC; Stock: 13115; Pricing: 1=0.47, 10=0.348, 50=0.348, 100=0.194, 1000=0.146, 10000=0.117 (USD); Mounting Technology: Surface Mount; Min Operating Temperature: -40°C; Max Operating Temperature: 125°C; Packaging: Cut Tape; Number of Circuits: 1; Series: -; RoHS Compliant: Yes; ComponentLink1URL: http://www.ti.com/lit/ds/symlink/tlv9001.pdf?src-supplier=Digikey; ComponentLink1Description: http://www.ti.com/lit/ds/symlink/tlv9001.pdf?src-supplier=Digikey; LCSC Part Number: C398362

## Sheet Motor-Connector.SchDoc
size 420 x 297 mm; SheetNumber: 3; SheetTotal: 7
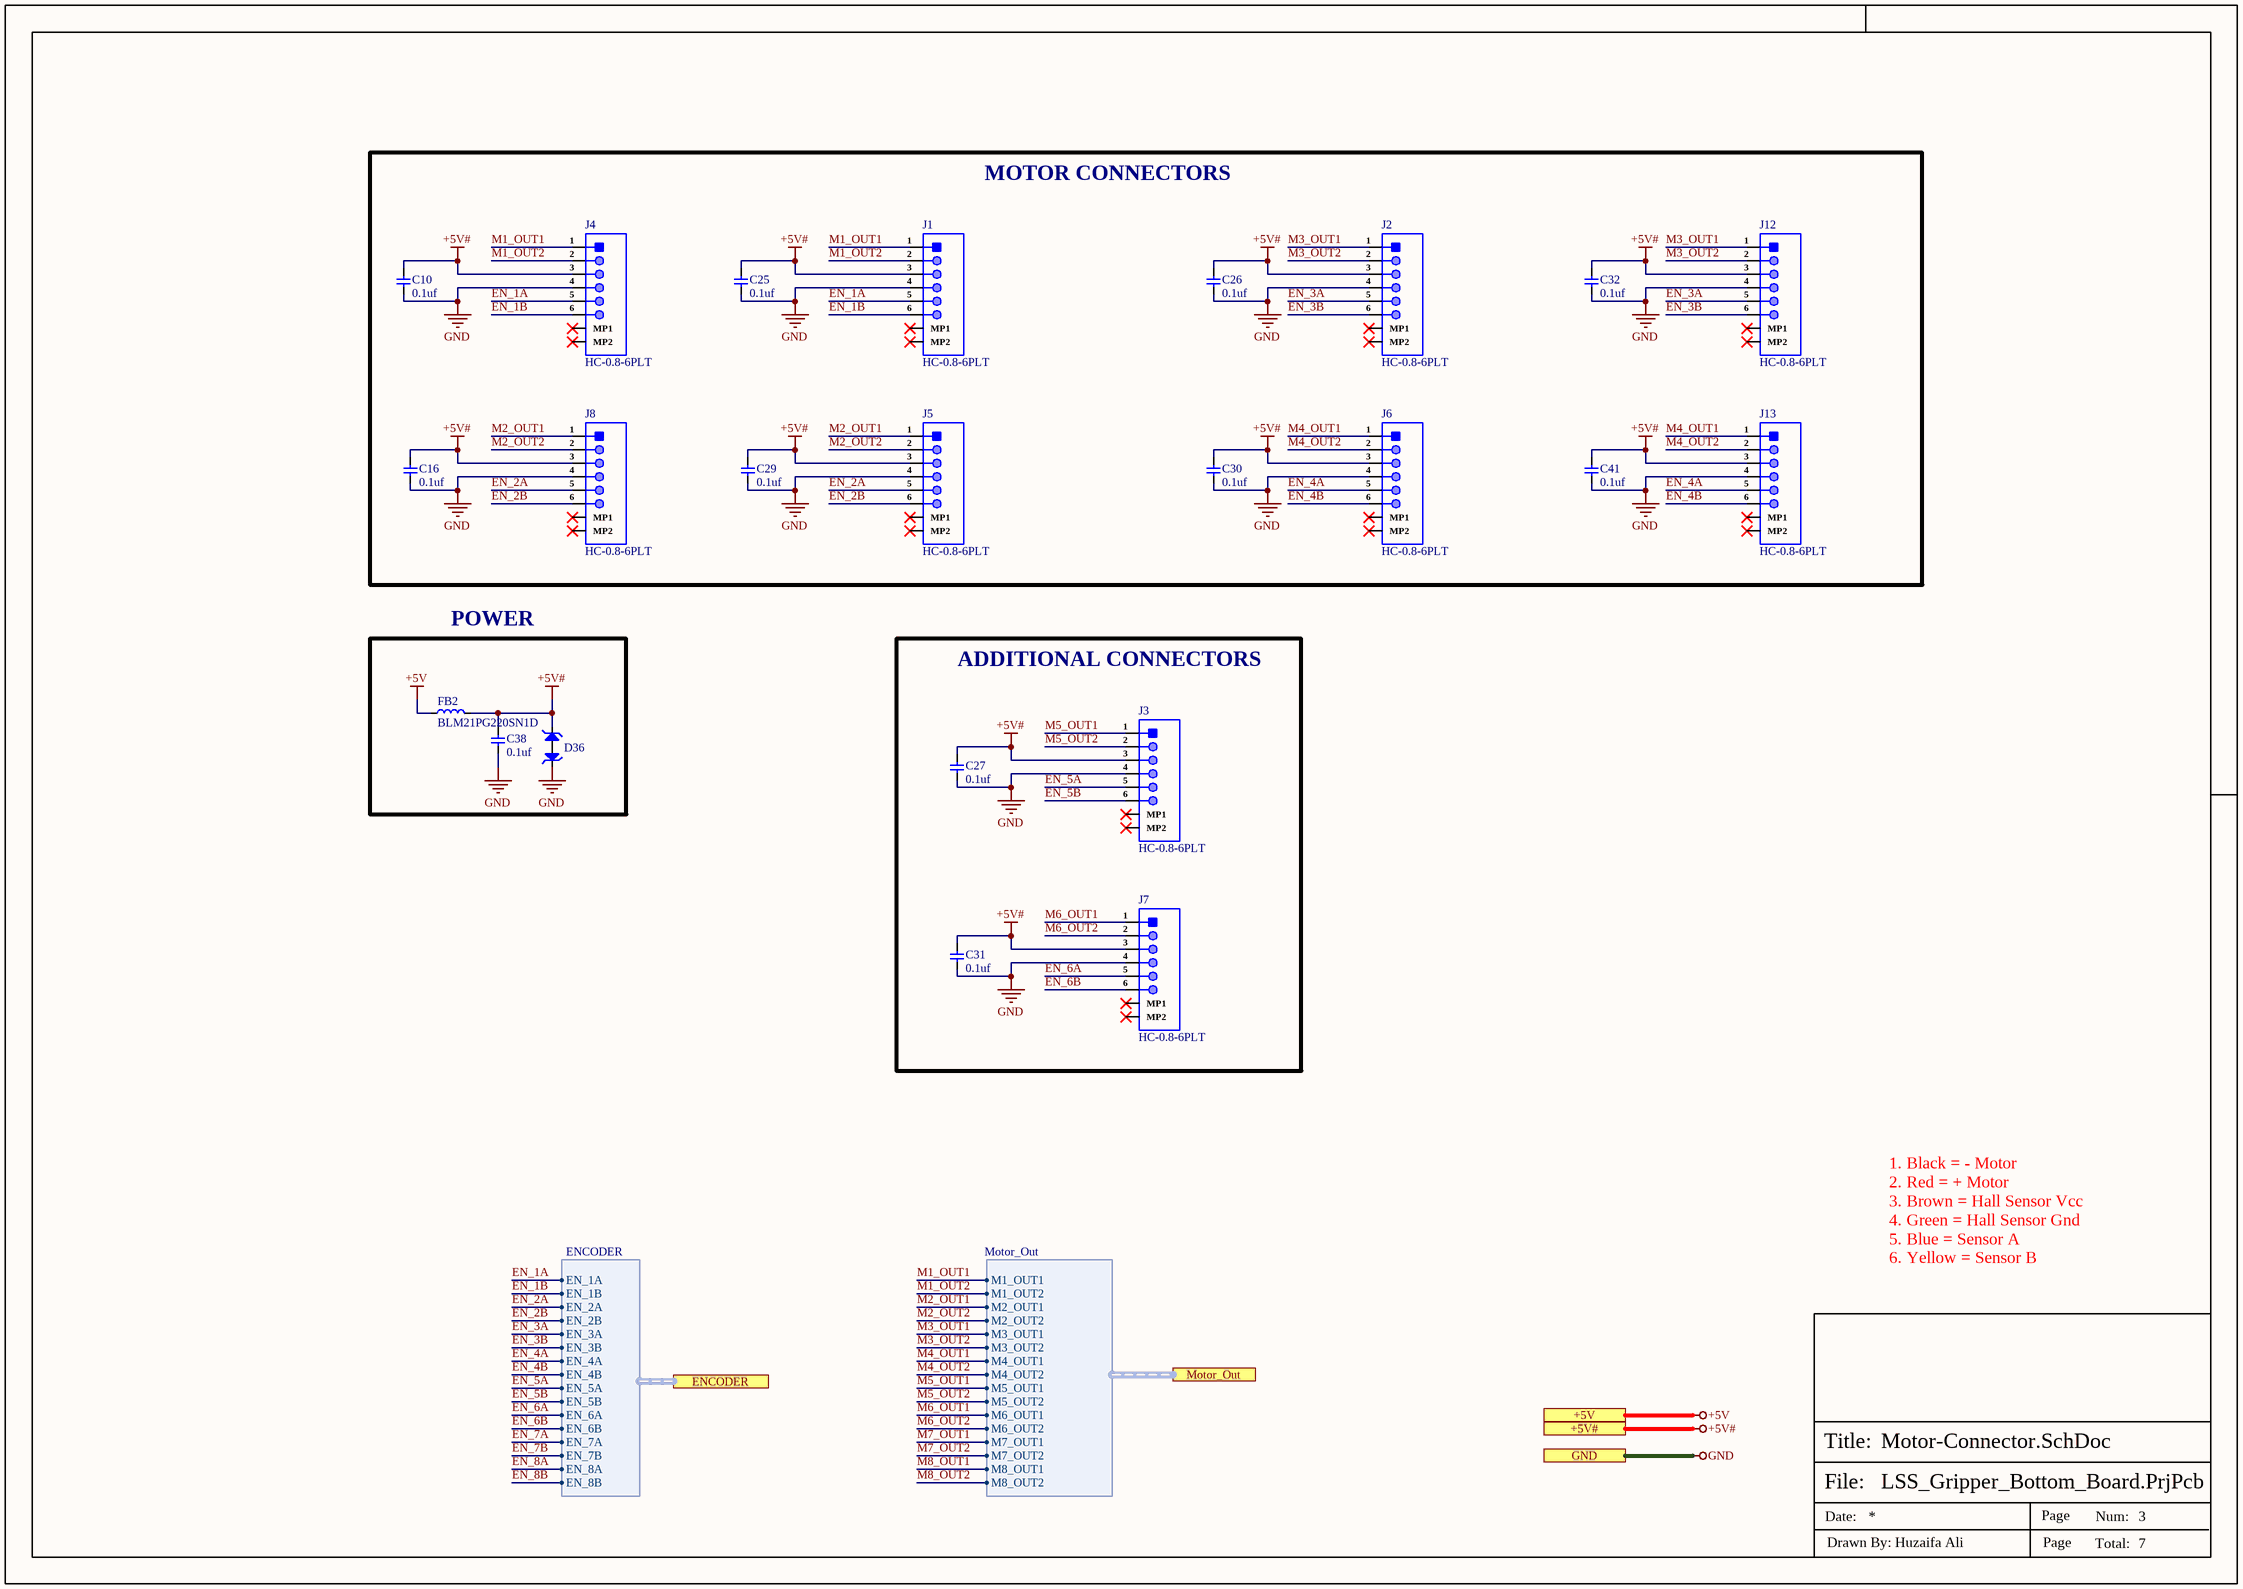
[diagram p5: Motor-Connector.SchDoc]

### Parts
C10  0.1uf  [Cap-0402]
C16  0.1uf  [Cap-0402]
C25  0.1uf  [Cap-0402]
C26  0.1uf  [Cap-0402]
C27  0.1uf  [Cap-0402]
C29  0.1uf  [Cap-0402]
C30  0.1uf  [Cap-0402]
C31  0.1uf  [Cap-0402]
C32  0.1uf  [Cap-0402]
C38  0.1uf  [Cap-0402]
C41  0.1uf  [Cap-0402]
D36  PESD5V0H1BSFYL  [DSN0603-2]  (value not drawn)
FB2  BLM21PG220SN1D  [Ind-0805]
J1  HC-0.8-6PLT  [HC-0.8-6PLT]
J2  HC-0.8-6PLT  [HC-0.8-6PLT]
J3  HC-0.8-6PLT  [HC-0.8-6PLT]
J4  HC-0.8-6PLT  [HC-0.8-6PLT]
J5  HC-0.8-6PLT  [HC-0.8-6PLT]
J6  HC-0.8-6PLT  [HC-0.8-6PLT]
J7  HC-0.8-6PLT  [HC-0.8-6PLT]
J8  HC-0.8-6PLT  [HC-0.8-6PLT]
J12  HC-0.8-6PLT  [HC-0.8-6PLT]
J13  HC-0.8-6PLT  [HC-0.8-6PLT]

### Blocks framed on the sheet
MOTOR CONNECTORS: C10 C16 C25 C26 C29 C30 C32 C41 J1 J2 J4-J6 J8 J12 J13
POWER: C38 D36 FB2
ADDITIONAL CONNECTORS: C27 C31 J3 J7

### Ports
+5V (see Top-Sheet[2B], Connector-Sheet[5D]), +5V# (see Top-Sheet[2B], CAN-Sheet[5D]), ENCODER (harness ENCODER, see Top-Sheet[2B], Controller-Sheet[1D]), GND (see Top-Sheet[2B], CAN-Sheet[5D], Connector-Sheet[5D], Controller-Sheet[5D], Current-Sense-Sheet[5D], Motor-Driver-Sheet[5D]), Motor_Out (harness Motor_Out, see Top-Sheet[2B], Motor-Driver-Sheet[4D])

### Harnesses
Motor_Out: M1_OUT1, M1_OUT2, M2_OUT1, M2_OUT2, M3_OUT1, M3_OUT2, M4_OUT1, M4_OUT2, M5_OUT1, M5_OUT2, M6_OUT1, M6_OUT2, M7_OUT1, M7_OUT2, M8_OUT1, M8_OUT2
ENCODER: EN_2B, EN_3A, EN_3B, EN_4A, EN_4B, EN_5A, EN_5B, EN_6A, EN_6B, EN_7A, EN_7B, EN_2A, EN_1B, EN_1A, EN_8A, EN_8B

### Nets
+5V: FB2.1 ; port +5V
+5V#: C10.2 C16.2 C25.2 C26.2 C27.2 C29.2 C30.2 C31.2 C32.2 C38.2 C41.2 D36.1 FB2.2 J1.3 J2.3 J3.3 J4.3 J5.3 J6.3 J7.3 J8.3 J12.3 J13.3 ; port +5V#
GND: C10.1 C16.1 C25.1 C26.1 C27.1 C29.1 C30.1 C31.1 C32.1 C38.1 C41.1 D36.2 J1.4 J2.4 J3.4 J4.4 J5.4 J6.4 J7.4 J8.4 J12.4 J13.4 ; port GND
EN_1A: J1.5 J4.5 ; port ENCODER.EN_1A
EN_1B: J1.6 J4.6 ; port ENCODER.EN_1B
EN_2A: J5.5 J8.5 ; port ENCODER.EN_2A
EN_2B: J5.6 J8.6 ; port ENCODER.EN_2B
EN_3A: J2.5 J12.5 ; port ENCODER.EN_3A
EN_3B: J2.6 J12.6 ; port ENCODER.EN_3B
EN_4A: J6.5 J13.5 ; port ENCODER.EN_4A
EN_4B: J6.6 J13.6 ; port ENCODER.EN_4B
EN_5A: J3.5 ; port ENCODER.EN_5A
EN_5B: J3.6 ; port ENCODER.EN_5B
EN_6A: J7.5 ; port ENCODER.EN_6A
EN_6B: J7.6 ; port ENCODER.EN_6B
EN_7A: port ENCODER.EN_7A
EN_7B: port ENCODER.EN_7B
EN_8A: port ENCODER.EN_8A
EN_8B: port ENCODER.EN_8B
M1_OUT1: J1.1 J4.1 ; port Motor_Out.M1_OUT1
M1_OUT2: J1.2 J4.2 ; port Motor_Out.M1_OUT2
M2_OUT1: J5.1 J8.1 ; port Motor_Out.M2_OUT1
M2_OUT2: J5.2 J8.2 ; port Motor_Out.M2_OUT2
M3_OUT1: J2.1 J12.1 ; port Motor_Out.M3_OUT1
M3_OUT2: J2.2 J12.2 ; port Motor_Out.M3_OUT2
M4_OUT1: J6.1 J13.1 ; port Motor_Out.M4_OUT1
M4_OUT2: J6.2 J13.2 ; port Motor_Out.M4_OUT2
M5_OUT1: J3.1 ; port Motor_Out.M5_OUT1
M5_OUT2: J3.2 ; port Motor_Out.M5_OUT2
M6_OUT1: J7.1 ; port Motor_Out.M6_OUT1
M6_OUT2: J7.2 ; port Motor_Out.M6_OUT2
M7_OUT1: port Motor_Out.M7_OUT1
M7_OUT2: port Motor_Out.M7_OUT2
M8_OUT1: port Motor_Out.M8_OUT1
M8_OUT2: port Motor_Out.M8_OUT2

Not connected (* = marked no-connect by the designer): J1 MP1* MP2*; J2 MP1* MP2*; J3 MP1* MP2*; J4 MP1* MP2*; J5 MP1* MP2*; J6 MP1* MP2*; J7 MP1* MP2*; J8 MP1* MP2*; J12 MP1* MP2*; J13 MP1* MP2*

### Notes on the sheet
- 1. Black = - Motor
  2. Red = + Motor
  3. Brown = Hall Sensor Vcc
  4. Green = Hall Sensor Gnd
  5. Blue = Sensor A
  6. Yellow = Sensor B
- File:
- Title:
- Date:
- Page
- Num:
- Total:
- Drawn By: Huzaifa Ali

### Library data of the parts
C10 C16 C25-C27 C29-C32 C38 C41 = GRM155R62A104KE14D: as C1 on sheet Controller-Sheet; Supplier 1: Arrow Electronics; Manufacturer Part Number: GRM155R62A104KE14D; RoHS: Yes; Category: Ceramic Capacitors; Stock 1: 870000; Pricing 1: 10000=0.00500, 20000=0.00410, 30000=0.00390, 50000=0.00370, 100000=0.00300 (USD); Mount: Surface Mount; Case/Package: 0402; Case Code (Metric): 1005; Case Code (Imperial): 0402; Weight: 0.000212oz; Min Operating Temperature: -55°C; Max Operating Temperature: 85°C; Packaging: Tape and Reel; Voltage Rating: 100V; Dielectric: X5R; Termination: SMD/SMT; Voltage Rating (DC): 100V; Package Quantity: 10000; Series: GRM; Length: 0.039inch; Width: 0.02inch; Height: 0.5mm; Thickness: 0.022inch; Reach SVHC Compliant: Yes; Lead Free: Lead Free; RoHS Compliant: Yes; ComponentLink1URL: http://www.farnell.com/datasheets/2079151.pdf?src-supplier=Farnell; ComponentLink1Description: http://www.farnell.com/datasheets/2079151.pdf?src-supplier=Farnell; ComponentLink2URL: http://www.mouser.com/ds/2/281/c02e-2905.pdf?src-supplier=Mouser; ComponentLink2Description: http://www.mouser.com/ds/2/281/c02e-2905.pdf?src-supplier=Mouser; ComponentLink3URL: http://www.farnell.com/datasheets/2079151.pdf?src-supplier=Element14; ComponentLink3Description: http://www.farnell.com/datasheets/2079151.pdf?src-supplier=Element14; ComponentLink4URL: http://search.murata.co.jp/Ceramy/image/img/A01X/G101/ENG/GRM155R62A104KE14-01.pdf?src-supplier=Digi-Key; ComponentLink4Description: http://search.murata.co.jp/Ceramy/image/img/A01X/G101/ENG/GRM155R62A104KE14-01.pdf?src-supplier=Digi-Key; ComponentLink5URL: http://www.farnell.com/datasheets/2079151.pdf?src-supplier=Newark; ComponentLink5Description: http://www.farnell.com/datasheets/2079151.pdf?src-supplier=Newark; Supplier Part Number 1: GRM155R62A104KE14D; LCSC Part Number: C162178
D36 = PESD5V0H1BSFYL: TVS DIODE 5VWM 6.3VC DSN0603-2; Manufacturer: Nexperia; Supplier 1: Avnet; Manufacturer Part Number: PESD5V0H1BSFYL; RoHS: Yes; Category: ESD and Circuit Protection ICs; Stock 1: 9000; Pricing 1: 18000=0.06453, 36000=0.06278, 54000=0.06104, 90000=0.05930, 180000=0.05755, 900000=0.05581, 1800000=0.05406 (USD); RoHS Compliant: Yes; ComponentLink1URL: http://www.farnell.com/datasheets/1961312.pdf?src-supplier=Farnell; ComponentLink1Description: http://www.farnell.com/datasheets/1961312.pdf?src-supplier=Farnell; ComponentLink2URL: https://assets.nexperia.com/documents/data-sheet/PESD5V0H1BSF.pdf?src-supplier=Digi-Key; ComponentLink2Description: https://assets.nexperia.com/documents/data-sheet/PESD5V0H1BSF.pdf?src-supplier=Digi-Key; ComponentLink3URL: http://www.farnell.com/datasheets/1961312.pdf?src-supplier=Newark; ComponentLink3Description: http://www.farnell.com/datasheets/1961312.pdf?src-supplier=Newark; Supplier Part Number 1: PESD5V0H1BSFYL; LCSC Part Number: C477989; Item Type: Diode
FB2 = BLM21PG220SN1D: as FB1 on sheet Controller-Sheet; Supplier: Rs; Supplier Part Number: 7241539P; Manufacturer Part Number: BLM21PG220SN1D; RoHS: Yes; Category: Ferrite Beads and Chips; Stock: 10325; Pricing: 500=0.043, 1000=0.038, 2500=0.033, 5000=0.03 (GBP); ComponentLink1URL: https://datasheet.ciiva.com/14122/anblm21p-data-e-14122211.pdf?src-supplier=Distrelec; ComponentLink1Description: https://datasheet.ciiva.com/14122/anblm21p-data-e-14122211.pdf?src-supplier=Distrelec; ComponentLink2URL: https://datasheet.ciiva.com/11799/0900766b81275e31-11799177.pdf?src-supplier=Rs; ComponentLink2Description: https://datasheet.ciiva.com/11799/0900766b81275e31-11799177.pdf?src-supplier=Rs; ComponentLink3URL: https://datasheet.ciiva.com/29700/1845312-29700540.pdf?src-supplier=Jameco; ComponentLink3Description: https://datasheet.ciiva.com/29700/1845312-29700540.pdf?src-supplier=Jameco; ComponentLink4URL: https://datasheet.ciiva.com/16291/l0110s0100blm21p-16291622.pdf?src-supplier=Future+Electronics; ComponentLink4Description: https://datasheet.ciiva.com/16291/l0110s0100blm21p-16291622.pdf?src-supplier=Future+Electronics; ComponentLink5URL: https://datasheet.ciiva.com/8021/5160-8021589.pdf?src-supplier=Element14; ComponentLink5Description: https://datasheet.ciiva.com/8021/5160-8021589.pdf?src-supplier=Element14; ComponentLink6URL: https://datasheet.ciiva.com/8021/5160-8021591.pdf?src-supplier=Element14; ComponentLink6Description: https://datasheet.ciiva.com/8021/5160-8021591.pdf?src-supplier=Element14; ComponentLink7URL: https://datasheet.ciiva.com/6211/l0110s0100blm21p-6211741.pdf?src-supplier=Digi-Key; ComponentLink7Description: https://datasheet.ciiva.com/6211/l0110s0100blm21p-6211741.pdf?src-supplier=Digi-Key; ComponentLink8URL: https://datasheet.ciiva.com/3081/l0110s0100blm21p-3081653.pdf?src-supplier=Avnet; ComponentLink8Description: https://datasheet.ciiva.com/3081/l0110s0100blm21p-3081653.pdf?src-supplier=Avnet; ComponentLink9URL: https://datasheet.ciiva.com/41449/001171738-da-01-en-chip-drossel0805-22r0-6000ma-2-0x1-25mm-41449366.pdf?src-supplier=Conrad; ComponentLink9Description: https://datasheet.ciiva.com/41449/001171738-da-01-en-chip-drossel0805-22r0-6000ma-2-0x1-25mm-41449366.pdf?src-supplier=Conrad; LCSC Part Number: C88993; Item Type: Ferrite Bead
J1-J8 J12 J13 = HC-0.8-6PLT: 1x6P 6P 1 Tin 0.8mm 6 -25℃~+85℃ Phosphor Bronze 500mA Standing paste SMD,P=0.8mm Wire To Board Connector ROHS; Manufacturer: HCTL; Manufacturer Part Number: HC-0.8-6PLT; Package: SMD,P=0.8mm; LCSC Part Number: C2845356; Item Type: Connector; ComponentLink1Description: LCSC; ComponentLink1URL: https://www.lcsc.com/product-detail/Wire-To-Board-Connector_HCTL-HC-0-8-6PLT_C2845356.html